# Altium schematic sheet 06-LASERCONTROL.SchDoc
size A4
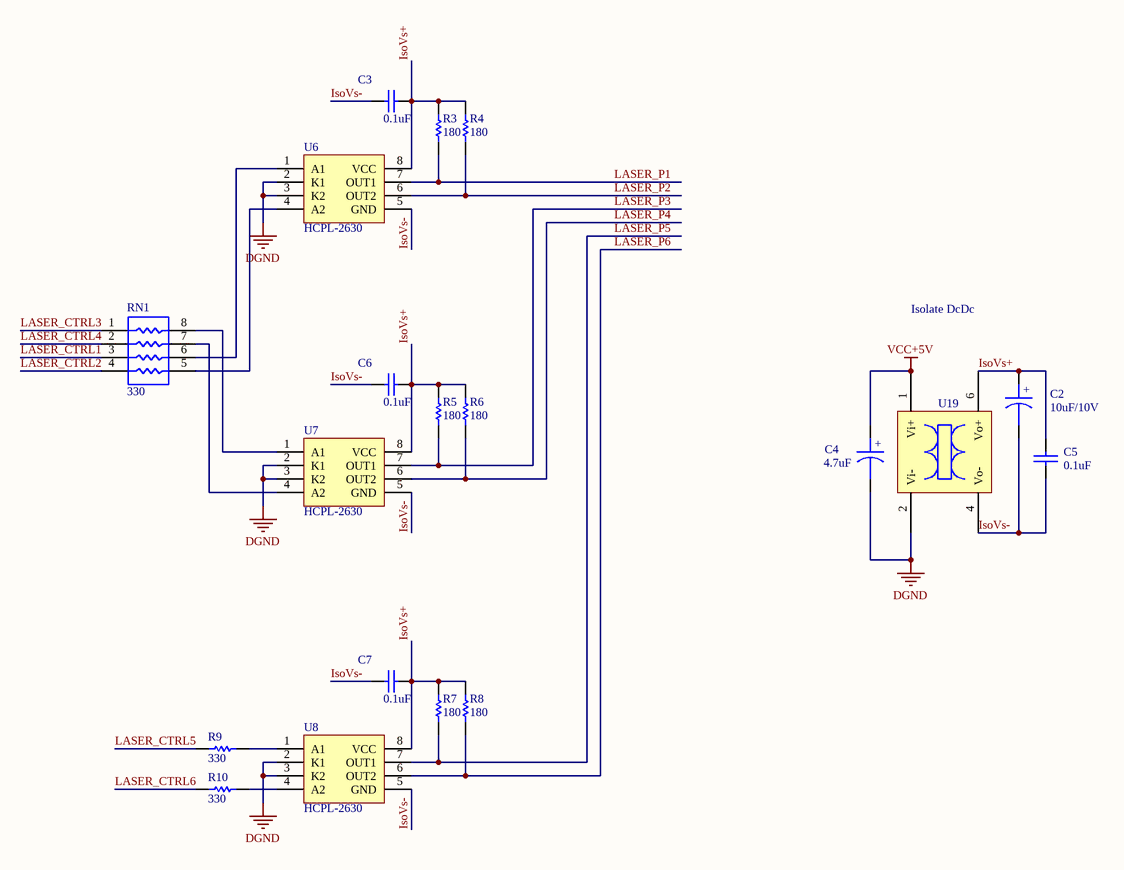
[diagram p0: 06-LASERCONTROL.SchDoc]

## Parts
C2  10uF/10V  [CC3225-1210]
C3  0.1uF  [CC2012-0805]
C4  4.7uF  [CC3225-1210]
C5  0.1uF  [0805-X]
C6  0.1uF  [CC2012-0805]
C7  0.1uF  [CC2012-0805]
R3  180  [CR2012-0805]
R4  180  [CR2012-0805]
R5  180  [CR2012-0805]
R6  180  [CR2012-0805]
R7  180  [CR2012-0805]
R8  180  [CR2012-0805]
R9  330  [0805]
R10  330  [0805]
RN1  330  [CRP4.1608]
U6  HCPL-2630  [SO-G8/Z10.8]
U7  HCPL-2630  [SO-G8/Z10.8]
U8  HCPL-2630  [SO-G8/Z10.8]
U19  Isolate DcDc  [IB0505LS]

## Nets
DGND: C4.2 U6.2(K1) U6.3(K2) U7.2(K1) U7.3(K2) U8.2(K1) U8.3(K2) U19.2(Vi-)
VCC+5V: C4.1 U19.1(Vi+)
IsoVs+: C2.1 C3.1 C5.1 C6.1 C7.1 R3.1 R4.1 R5.1 R6.1 R7.1 R8.1 U6.8(VCC) U7.8(VCC) U8.8(VCC) U19.6(Vo+)
IsoVs-: C2.2 C3.2 C5.2 C6.2 C7.2 U6.5(GND) U7.5(GND) U8.5(GND) U19.4(Vo-)
LASER_CTRL1: RN1.3
LASER_CTRL2: RN1.4
LASER_CTRL3: RN1.1
LASER_CTRL4: RN1.2
LASER_CTRL5: R9.1
LASER_CTRL6: R10.1
LASER_P1: R3.2 U6.7(OUT1)
LASER_P2: R4.2 U6.6(OUT2)
LASER_P3: R5.2 U7.7(OUT1)
LASER_P4: R6.2 U7.6(OUT2)
LASER_P5: R7.2 U8.7(OUT1)
LASER_P6: R8.2 U8.6(OUT2)
NetR9_2: R9.2 U8.1(A1)
NetR10_2: R10.2 U8.4(A2)
NetRN1_5: RN1.5 U6.4(A2)
NetRN1_6: RN1.6 U6.1(A1)
NetRN1_7: RN1.7 U7.4(A2)
NetRN1_8: RN1.8 U7.1(A1)

## Notes on the sheet
- (in symbol CAPACITOR POL) +

## Library data of the parts
C2 C4 = CAPACITOR POL: Capacitor
C3 C6 C7 = Cap: Capacitor; Value: 100pF; Published: 8-Jun-2000; LatestRevisionDate: 17-Jul-2002; LatestRevisionNote: Re-released for DXP Platform.; PackageReference: RAD-0.3; Publisher: Altium Limited
C5 = CAP: Capacitor
R3-R10 = Res1: Resistor; Value: 1K; Published: 8-Jun-2000; LatestRevisionDate: 17-Jul-2002; LatestRevisionNote: Re-released for DXP Platform.; PackageReference: AXIAL-0.3; Publisher: Altium Limited
RN1 = RN4: Resistor Array,include 4 resistor in one chip
U19 = MY_I_DC_DC